# EAGLE schematic nano_power (EAGLE 7.7.0)
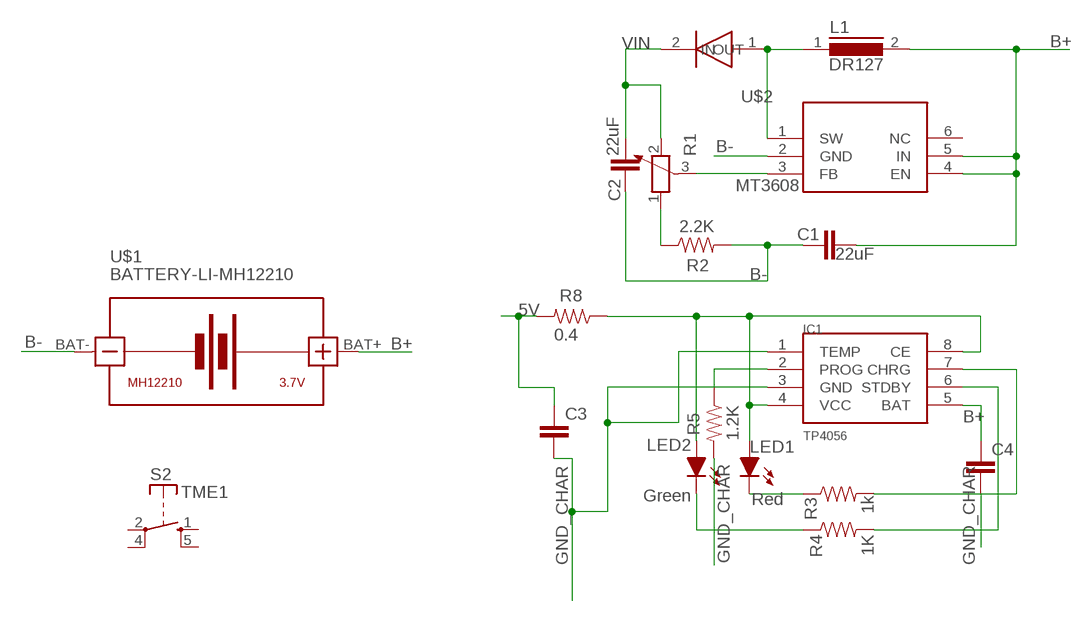
[diagram p0: schematic, sheet 1]

## Parts
C1  22uF  CAP_0805  [SMD0805]
C2  22uF  CAP_0805  [SMD0805]
C3  CAP_0805  [SMD0805]
C4  CAP_0805  [SMD0805]
IC1  TP4056  [SOP-8]
L1  DR127  [DR127]
LED1  Red  LED_0603  [LED_0603]
LED2  Green  LED_0603  [LED_0603]
R1  POTENTIOMETER_PT-10  [PT-10]
R2  2.2K  RES_0603  [SMD0603]
R3  1k  RES_0603  [SMD0603]
R4  1K  RES_0603  [SMD0603]
R5  1.2K  RES_0603  [SMD0603]
R8  0.4  RES_0805  [SMD0805]
S2  TME1  [TME1]
U$1  BATTERY-LI-MH12210  [BATTERY-LI-MH12210]
U$2  MT3608  [SOT23-6]
U$3  SMA-SS34  [SMA-SS34]

## Nets
5V: C3.1 R8.2
B+: C1.2 C4.1 IC1.5(BAT) L1.2 U$1.BAT+ U$2.4(EN) U$2.5(IN)
B-: C1.1 C2.1 R2.2 U$1.BAT- U$2.2(GND)
GND_CHAR: C3.2 C4.2 IC1.1(TEMP) IC1.3(GND) R5.2
N$6: LED1.C R3.1
N$7: IC1.2(PROG) R5.1
N$8: R1.3 U$2.3(FB)
N$9: R1.1 R2.1
N$10: IC1.7(CHRG) R3.2
N$11: L1.1 U$2.1(SW) U$3.1(IN)
N$12: LED2.C R4.1
N$13: IC1.6(STDBY) R4.2
N$16: IC1.4(VCC) IC1.8(CE) LED1.A LED2.A R8.1
VIN: C2.2 R1.2 U$3.2(OUT)
Unconnected: S2.1(S) S2.2(P) S2.4(P) S2.5(S) U$2.6(NC)

## Library data of the parts
C1-C4 = eagle-book:CAP: Non-polarized capacitor
IC1 = TP4056:TP4056
L1 = inductors:DR127: High Power Density, High Efficiency, Shielded Inductors Source: coiltronics_dr_series.pdf
LED1 LED2 = eagle-book:LED: Light Emitting Diode
R1 = rcl:POTENTIOMETER_: Potentiometer
R2-R5 R8 = eagle-book:RES: Resistor
S2 = switch-misc:TME1: SWITCH
U$1 = diy-modules:BATTERY-LI-MH12210: Lithium-Ion MH12210 Rechargeable Battery Panasonic NCR18650PF battery datasheet available here: https://industrial.panasonic.com/cdbs/www-data/pdf2/ACI4000/ACI4000C12.pdf Click here to find device on ebay.com <http://www.ebay.com/sch/ncr18650b+battery>
U$2 = ltc_swr:MT3608
U$3 = SMA-SS34:SMA-SS34

## Net classes
0 default: width 0.203 mm
1 VCC: width 0.305 mm, drill 0.406 mm
2 VIN: width 0.305 mm, drill 0.406 mm
3 AREF: width 0.254 mm, drill 0.406 mm
4 GND: width 0.254 mm, drill 0.406 mm